# Altium project ESP32_RGB_Controller.PrjPcb
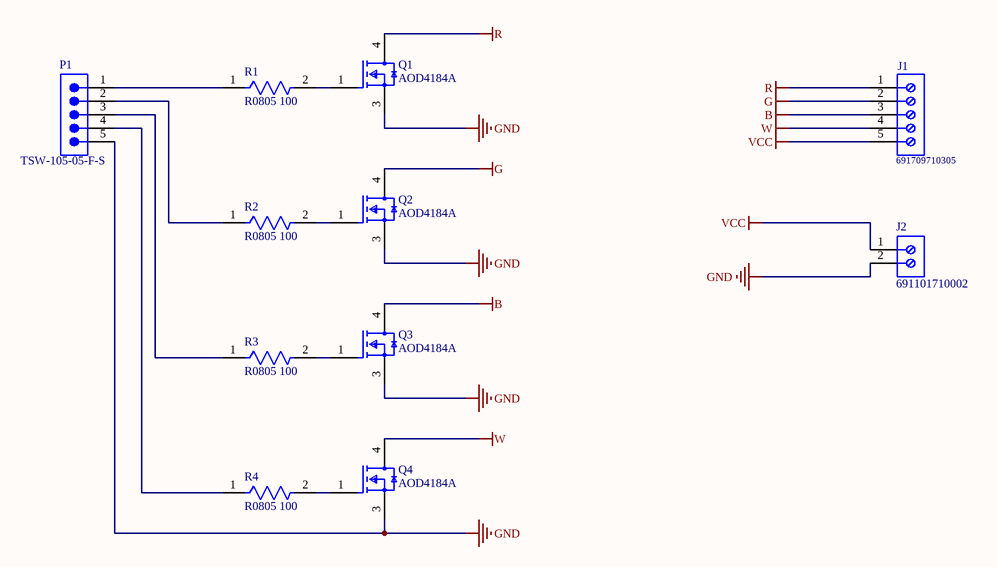
[diagram p0: ESP32_RGB_Controller.SchDoc]
1 sheet, 11 parts. Net scope: global (net labels, ports and power ports of the same name join across sheets).
Board files: ESP32_RGB_Controller.PcbDoc, ESP32_RGB_Controller-v2.PcbDoc

## Sheet ESP32_RGB_Controller.SchDoc
size A4; SheetNumber: 1; SheetTotal: 1

### Parts
J1  691709710305  [691709710305]
J2  691101710002  [691101710002]
P1  TSW-105-05-F-S  [SMTC-TSW-105-05-X-S]
Q1  AOD4184A  [FP-TO252-MFG]
Q2  AOD4184A  [FP-TO252-MFG]
Q3  AOD4184A  [FP-TO252-MFG]
Q4  AOD4184A  [FP-TO252-MFG]
R1  R0805 100  [FP-SR0805-MFG]
R2  R0805 100  [FP-SR0805-MFG]
R3  R0805 100  [FP-SR0805-MFG]
R4  R0805 100  [FP-SR0805-MFG]

### Nets
B: J1.3 Q3.4(D)
G: J1.2 Q2.4(D)
GND: J2.2 P1.5 Q1.3(S) Q2.3(S) Q3.3(S) Q4.3(S)
R: J1.1 Q1.4(D)
VCC: J1.5 J2.1
W: J1.4 Q4.4(D)
NetP1_1: P1.1 R1.1
NetP1_2: P1.2 R2.1
NetP1_3: P1.3 R3.1
NetP1_4: P1.4 R4.1
NetQ1_1: Q1.1(G) R1.2
NetQ2_1: Q2.1(G) R2.2
NetQ3_1: Q3.1(G) R3.2
NetQ4_1: Q4.1(G) R4.2

### Library data of the parts
J1 = CMP-1502-03338-1: Serie 7097 - 5.00 mm Horizontal Entry SMT with Pressure Clamp WR-TBL, 5 pin; Manufacturer: Wurth Elektronik; Pitch: 5.00mm; Pin Number: 5; Packaging: TapeandReelwithCap; Operating Temperature: -45to130degC; Mounting Technology: SMT; Part Number: 691709710305; Publisher: WurthElektronik; Manufacturer URL: http://www.we-online.de; Datasheet URL: http://katalog.we-online.de/em/datasheet/6917097103xx.pdf; Package Reference: 691709710305
J2 = CMP-1502-03256-1: Series 101 - 5.00 mm Horizontal Entry Modular with Pressure Clamp WR-TBL, 2 pin; Manufacturer: Wurth Elektronik; Pin Number: 2; Pitch: 5.00mm; Package Reference: 691101710002; Part Number: 691101710002; Publisher: WurthElektronik; Datasheet URL: http://katalog.we-online.de/em/datasheet/6911017100xx.pdf; Packaging: Box; Operating Temperature: -40to105degC; Manufacturer URL: http://www.we-online.de; Mounting Technology: THT
P1 = CMP-1024-00365-1: 0.025" SQ Post Header, Through-hole, Vertical, -55 to 125 degC, 2.54 mm Pitch, 5-Pin, Male, RoHS; Manufacturer: Samtec; Pitch: 2.54 mm; PackageReference: TSW-105-05-X-S; ComponentLink1Description: Manufacturer URL; Temperature Range: -55 to 125 degC; ComponentLink2Description: Datasheet; ComponentLink2URL: http://www.samtec.com/documents/webfiles/pdf/TSW_TH.PDF; PartNumber: TSW-105-05-F-S; ComponentLink3URL: http://www.samtec.com/documents/webfiles/cpdf/TSW-XXX-XX-XXX-X-XX-XXX-MKT.pdf; ComponentLink1URL: http://www.samtec.com; DatasheetVersion: F-214; Mounting Technology: Through-hole; RoHS: True; PackageVersion: DM, 8/1988; ComponentLink3Description: Package Specification; PackageDescription: .025[0.64] SQ. Post Terminal Strip Assembly; Orientation: Vertical
Q1-Q4 = CMP-83955-000007-1: MOSFET N-CH 40V 50A TO252; Power Dissipation: 50W; Rds On Max: 7mR; Input Capacitance: 1.8nF; Gate to Source Voltage (Vgs): 20V; Number of Elements: 1; Max Power Dissipation: 2.3W; Min Operating Temperature: -55°C; Drain to Source Voltage (Vdss): 40V; Max Operating Temperature: 175°C; Case/Package: DPAK; Mount: Surface Mount; Continuous Drain Current (ID): 50A; Packaging: Cut Tape; Number of Pins: 3; Radiation Hardening: No
R1-R4 = CMP-03412-018383-1: RES 100 OHM 1% 1/2W 0805; Manufacturer: Yageo; Manufacturer Part Number: SR0805FR-47100RL; Automotive Grade: Grade 0; Value: 100Ω; Tolerance: 0.01; Power Rating: 0.5W; Voltage Rating: 150V; Lead Free: Yes; Temperature Range High: +155°C; Category: Res; Temperature: -55°C to +155°C; Device Class L3: Chip SMD Resistors; Device Class L1: Passive Components; Temperature Range Low: -55°C; Digikey Description: RES 100 OHM 1% 1/2W 0805; RoHS: TRUE; Series: SR; Package: SR0805; Ipc Land Pattern Name: RESC200125X50; ComponentLink2URL: http://www.yageo.com/documents/recent/PYu-SR_D_F%20tol_RoHS_L_3.pdf; Automotive: Yes; Octopart: https://octopart.com/sr0805fr-47100rl-yageo-91478093; Composition: Thick Film; Resistance: 100Ω; Device Class L2: Resistors; Height: 0.6mm; ComponentLink2Description: Datasheet; Footprint Url: http://www.yageo.com/exep/pages/download/literatures/PYu-R_Mount_10.pdf